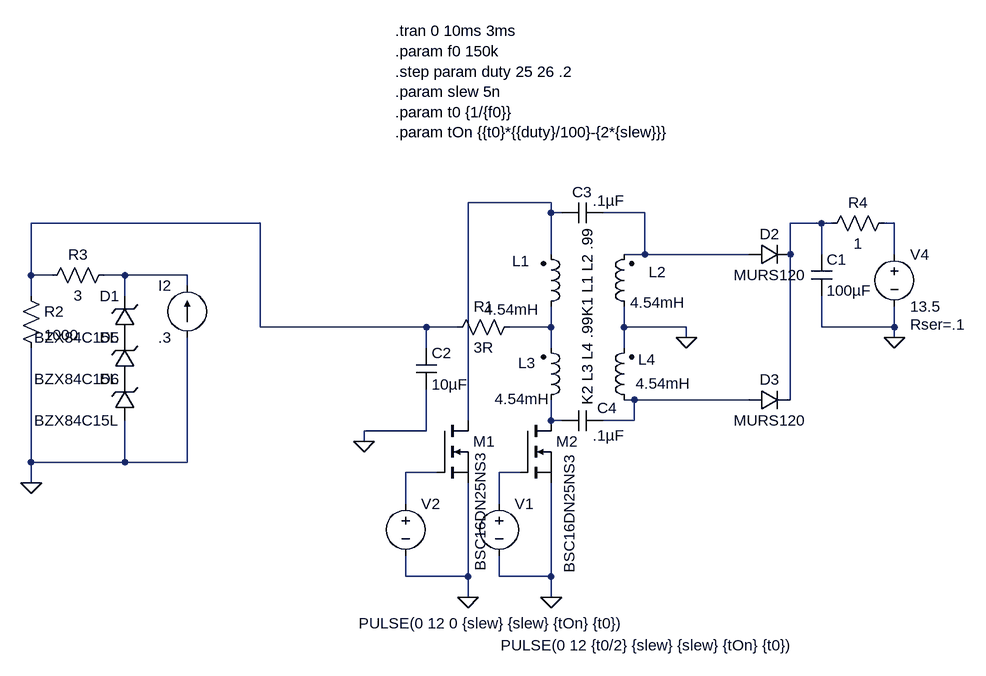
[diagram p0: schematic weinberg.asc]
weinberg.asc, the LTspice schematic file:
Version 4
SHEET 1 936 700
WIRE 176 0 48 0
WIRE 176 16 176 0
WIRE 192 16 176 16
WIRE 320 16 256 16
WIRE -272 32 -624 32
WIRE 592 32 544 32
WIRE 608 32 592 32
WIRE 704 32 688 32
WIRE 176 80 176 16
WIRE 320 80 320 16
WIRE 320 80 288 80
WIRE 480 80 320 80
WIRE 544 80 544 32
WIRE 592 80 592 32
WIRE 704 80 704 32
WIRE -624 112 -624 32
WIRE -592 112 -624 112
WIRE -480 112 -512 112
WIRE -384 112 -480 112
WIRE -384 128 -384 112
WIRE -624 144 -624 112
WIRE -480 144 -480 112
WIRE -272 192 -272 32
WIRE -16 192 -272 192
WIRE 32 192 -16 192
WIRE 176 192 176 160
WIRE 176 192 112 192
WIRE 288 192 288 160
WIRE 384 192 288 192
WIRE 592 192 592 144
WIRE 704 192 704 160
WIRE 704 192 592 192
WIRE 384 208 384 192
WIRE 704 208 704 192
WIRE -16 224 -16 192
WIRE 176 224 176 192
WIRE 288 224 288 192
WIRE 304 304 288 304
WIRE 480 304 304 304
WIRE 544 304 544 80
WIRE 48 336 48 0
WIRE 176 336 176 304
WIRE 192 336 176 336
WIRE 304 336 304 304
WIRE 304 336 256 336
WIRE -16 352 -16 288
WIRE -16 352 -112 352
WIRE -112 368 -112 352
WIRE -624 400 -624 224
WIRE -480 400 -480 336
WIRE -480 400 -624 400
WIRE -384 400 -384 208
WIRE -384 400 -480 400
WIRE 0 416 -48 416
WIRE 128 416 96 416
WIRE -624 432 -624 400
WIRE -48 464 -48 416
WIRE 96 464 96 416
WIRE -48 576 -48 544
WIRE 48 576 48 432
WIRE 48 576 -48 576
WIRE 96 576 96 544
WIRE 176 576 176 432
WIRE 176 576 96 576
WIRE 48 608 48 576
WIRE 176 608 176 576
FLAG 384 208 0
FLAG 176 608 0
FLAG 48 608 0
FLAG -112 368 0
FLAG 704 208 0
FLAG -624 432 0
SYMBOL ind2 160 176 M180
WINDOW 0 -44 86 Left 2
WINDOW 3 -87 11 Left 2
SYMATTR InstName L1
SYMATTR Value 4.54mH
SYMATTR Type ind
SYMATTR SpiceLine Rser=.2
SYMBOL ind2 304 176 R180
WINDOW 0 -49 69 Left 2
WINDOW 3 -78 22 Left 2
SYMATTR InstName L2
SYMATTR Value 4.54mH
SYMATTR Type ind
SYMATTR SpiceLine Rser=.2
SYMBOL ind2 160 320 M180
WINDOW 0 -35 73 Left 2
WINDOW 3 -71 17 Left 2
SYMATTR InstName L3
SYMATTR Value 4.54mH
SYMATTR Type ind
SYMATTR SpiceLine Rser=.2
SYMBOL ind2 304 320 R180
WINDOW 0 -33 78 Left 2
WINDOW 3 -87 41 Left 2
SYMATTR InstName L4
SYMATTR Value 4.54mH
SYMATTR Type ind
SYMATTR SpiceLine Rser=.2
SYMBOL diode 480 96 R270
WINDOW 0 32 32 VTop 2
WINDOW 3 0 32 VBottom 2
SYMATTR InstName D2
SYMATTR Value MURS120
SYMBOL diode 480 320 R270
WINDOW 0 32 32 VTop 2
WINDOW 3 0 32 VBottom 2
SYMATTR InstName D3
SYMATTR Value MURS120
SYMBOL voltage 96 448 R0
WINDOW 3 2 234 Left 2
WINDOW 123 0 0 Left 2
WINDOW 39 0 0 Left 2
SYMATTR Value PULSE(0 12 {t0/2} {slew} {slew} {tOn} {t0})
SYMATTR InstName V1
SYMBOL voltage -48 448 R0
WINDOW 3 -72 200 Left 2
WINDOW 123 0 0 Left 2
WINDOW 39 0 0 Left 2
SYMATTR Value PULSE(0 12 0 {slew} {slew} {tOn} {t0})
SYMATTR InstName V2
SYMBOL nmos 0 336 R0
WINDOW 3 67 48 VRight 2
SYMATTR Value BSC16DN25NS3
SYMATTR InstName M1
SYMBOL nmos 128 336 R0
WINDOW 3 76 51 VRight 2
SYMATTR Value BSC16DN25NS3
SYMATTR InstName M2
SYMBOL cap 576 80 R0
SYMATTR InstName C1
SYMATTR Value 100µF
SYMATTR SpiceLine Rser=0
SYMBOL cap 256 0 R90
WINDOW 0 0 32 VBottom 2
WINDOW 3 -18 -8 VTop 2
SYMATTR InstName C3
SYMATTR Value .1µF
SYMATTR SpiceLine Rser=.3
SYMBOL cap 256 320 R90
WINDOW 0 12 -6 VBottom 2
WINDOW 3 23 -8 VTop 2
SYMATTR InstName C4
SYMATTR Value .1µF
SYMATTR SpiceLine Rser=.3
SYMBOL voltage 704 64 R0
WINDOW 123 0 0 Left 2
WINDOW 39 24 124 Left 2
SYMATTR InstName V4
SYMATTR Value 13.5
SYMATTR SpiceLine Rser=.1
SYMBOL cap -32 224 R0
SYMATTR InstName C2
SYMATTR Value 10µF
SYMBOL res 16 208 R270
WINDOW 0 32 56 VTop 2
WINDOW 3 0 56 VBottom 2
SYMATTR InstName R1
SYMATTR Value 3R
SYMBOL res -640 128 R0
SYMATTR InstName R2
SYMATTR Value 1000
SYMBOL res -496 96 R90
WINDOW 0 0 56 VBottom 2
WINDOW 3 32 56 VTop 2
SYMATTR InstName R3
SYMATTR Value 3
SYMBOL zener -464 208 R180
WINDOW 0 24 64 Left 2
WINDOW 3 24 0 Left 2
SYMATTR InstName D1
SYMATTR Value BZX84C15L
SYMATTR Description Diode
SYMATTR Type diode
SYMBOL current -384 208 R180
WINDOW 0 24 80 Left 2
WINDOW 3 24 0 Left 2
WINDOW 123 0 0 Left 2
WINDOW 39 0 0 Left 2
SYMATTR InstName I2
SYMATTR Value .3
SYMBOL zener -464 272 R180
WINDOW 0 24 64 Left 2
WINDOW 3 24 0 Left 2
SYMATTR InstName D5
SYMATTR Value BZX84C15L
SYMATTR Description Diode
SYMATTR Type diode
SYMBOL zener -464 336 R180
WINDOW 0 24 64 Left 2
WINDOW 3 24 0 Left 2
SYMATTR InstName D6
SYMATTR Value BZX84C15L
SYMATTR Description Diode
SYMATTR Type diode
SYMBOL res 704 16 R90
WINDOW 0 0 56 VBottom 2
WINDOW 3 32 56 VTop 2
SYMATTR InstName R4
SYMATTR Value 1
TEXT 232 312 VLeft 2 !K2 L3 L4 .99
TEXT 232 176 VLeft 2 !K1 L1 L2 .99
TEXT -64 -264 Left 2 !.tran 0 10ms 3ms\n.param f0 150k\n.step param duty 25 26 .2\n.param slew 5n\n.param t0 {1/{f0}}\n.param tOn {{t0}*{{duty}/100}-{2*{slew}}}

The netlist it stands for:
* weinberg.asc
L1 N007 N001 4.54mH Rser=.2
L2 0 N002 4.54mH Rser=.2
L3 N009 N007 4.54mH Rser=.2
L4 N008 0 4.54mH Rser=.2
D2 N002 N004 MURS120
D3 N008 N004 MURS120
V1 N011 0 PULSE(0 12 {t0/2} {slew} {slew} {tOn} {t0})
V2 N010 0 PULSE(0 12 0 {slew} {slew} {tOn} {t0})
M1 N001 N010 0 0 BSC16DN25NS3
M2 N009 N011 0 0 BSC16DN25NS3
C1 N004 0 100µF Rser=0
C3 N002 N001 .1µF Rser=.3
C4 N008 N009 .1µF Rser=.3
V4 N005 0 13.5 Rser=.1
C2 N003 0 10µF
R1 N003 N007 3R
R2 N003 0 1000
R3 N006 N003 3
D1 P001 N006 BZX84C15L
I2 0 N006 .3
D5 P002 P001 BZX84C15L
D6 0 P002 BZX84C15L
R4 N005 N004 1
.model D D
.lib standard.dio
.model NMOS NMOS
.model PMOS PMOS
.lib standard.mos
K2 L3 L4 .99
K1 L1 L2 .99
.tran 0 10ms 3ms
.param f0 150k
.step param duty 25 26 .2
.param slew 5n
.param t0 {1/{f0}}
.param tOn {{t0}*{{duty}/100}-{2*{slew}}}
.backanno
.end